# Altium project PCB_Project.PrjPcb
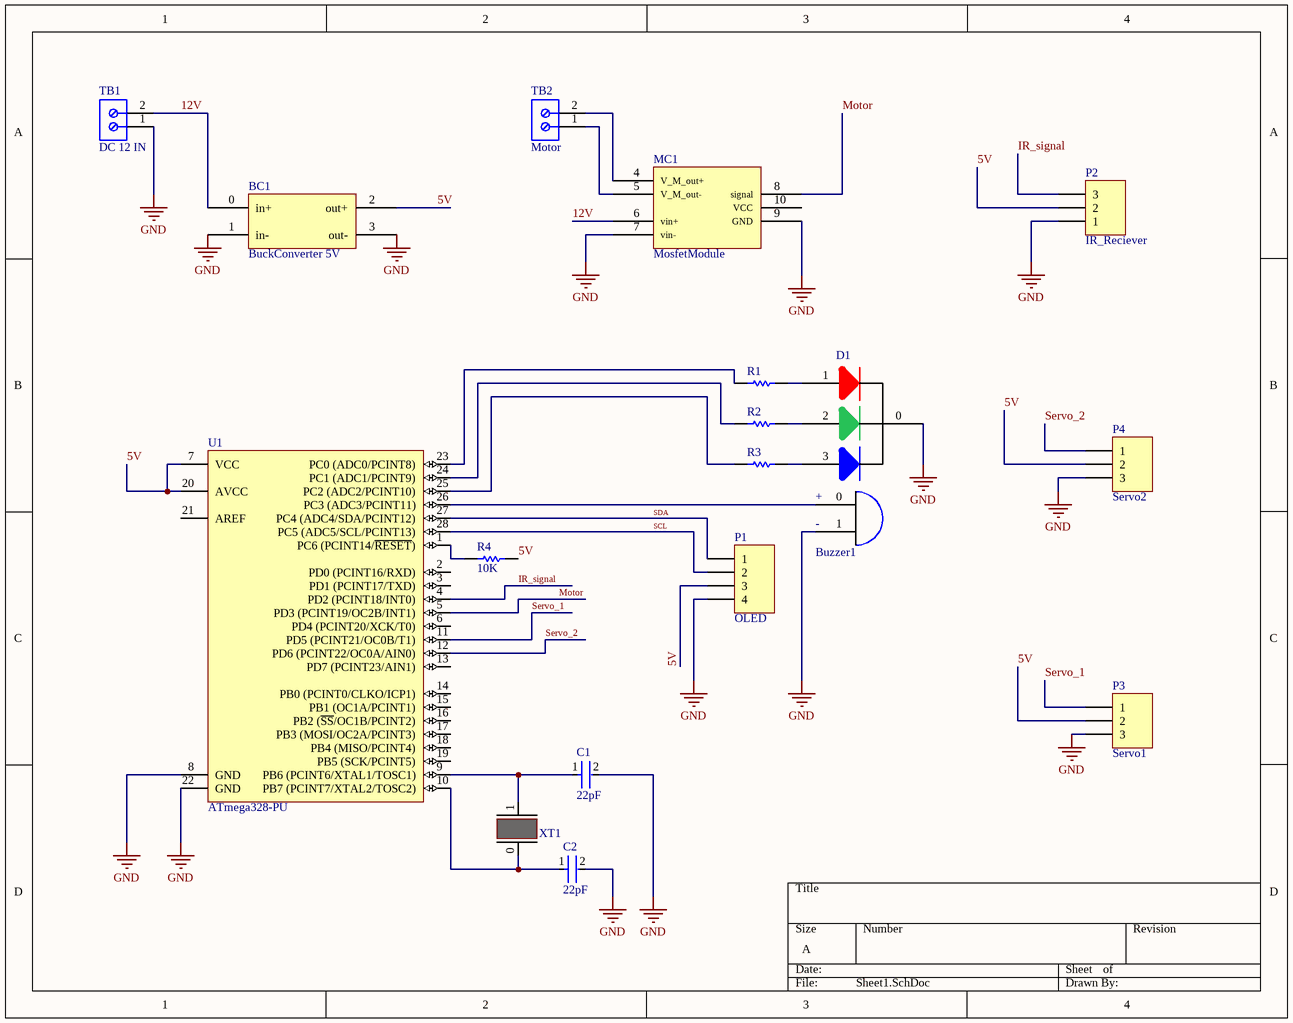
[diagram p0: Sheet1.SchDoc]
1 sheet, 18 parts. Net scope: global (net labels, ports and power ports of the same name join across sheets).
Board file: PCB1.PcbDoc

## Sheet Sheet1.SchDoc
size A; SheetNumber: 1; SheetTotal: 1

### Parts
BC1  BuckConverter 5V  [BUCK]
Buzzer1  Buzzer  [Buzzer]  (value not drawn)
C1  22pF  [FP-RDE0M1-MFG]
C2  22pF  [FP-RDE0M1-MFG]
D1  check foot print and real model  [RGB_LED]  (value not drawn)
MC1  MosfetModule  [MosfetMoterDriver]
P1  OLED  [HDR1X4]
P2  IR_Reciever  [HDR1X3]
P3  Servo1  [HDR1X3]
P4  Servo2  [HDR1X3]
R1  MFR-25FBF52-1K  [RESA60-630X240]  (value not drawn)
R2  MFR-25FBF52-1K  [RESA60-630X240]  (value not drawn)
R3  MFR-25FBF52-1K  [RESA60-630X240]  (value not drawn)
R4  10K  [RESA60-630X240]
TB1  DC 12 IN  [Terminal Block]
TB2  Motor  [Terminal Block]
U1  ATmega328-PU  [28P3]
XT1  Crystal Oscillator  [CrystalOscillator]  (value not drawn)

### Nets
GND: BC1.1(in-) BC1.3(out-) Buzzer1.1 C1.2 C2.2 D1.0 MC1.7(vin-) MC1.9(GND) P1.4 P2.1 P3.3 P4.3 TB1.1 U1.8(GND) U1.22(GND)
5V: BC1.2(out+) P1.3 P2.2 P3.2 P4.2 R4.2 U1.7(VCC) U1.20(AVCC)
12V: BC1.0(in+) MC1.6(vin+) TB1.2
IR_signal: P2.3 U1.4(PD2_(PCINT18/INT0))
Motor: MC1.8(signal) U1.5(PD3_(PCINT19/OC2B/INT1))
SCL: P1.2 U1.28(PC5_(ADC5/SCL/PCINT13))
SDA: P1.1 U1.27(PC4_(ADC4/SDA/PCINT12))
Servo_1: P3.1 U1.11(PD5_(PCINT21/OC0B/T1))
Servo_2: P4.1 U1.12(PD6_(PCINT22/OC0A/AIN0))
NetBuzzer1_0: Buzzer1.0 U1.26(PC3_(ADC3/PCINT11))
NetC1_1: C1.1 U1.9(PB6_(PCINT6/XTAL1/TOSC1)) XT1.1
NetC2_1: C2.1 U1.10(PB7_(PCINT7/XTAL2/TOSC2)) XT1.0
NetD1_1: D1.1 R1.2
NetD1_2: D1.2 R2.2
NetD1_3: D1.3 R3.2
NetMC1_4: MC1.4(V_M_out+) TB2.2
NetMC1_5: MC1.5(V_M_out-) TB2.1
NetR1_1: R1.1 U1.23(PC0_(ADC0/PCINT8))
NetR2_1: R2.1 U1.24(PC1_(ADC1/PCINT9))
NetR3_1: R3.1 U1.25(PC2_(ADC2/PCINT10))
NetR4_1: R4.1 U1.1(PC6_(PCINT14/~{RESET}))

Not connected (* = marked no-connect by the designer): MC1 10(VCC); U1 2(PD0_(PCINT16/RXD)) 3(PD1_(PCINT17/TXD)) 6(PD4_(PCINT20/XCK/T0)) 13(PD7_(PCINT23/AIN1)) 14(PB0_(PCINT0/CLKO/ICP1)) 15(PB1_(OC1A/PCINT1)) 16(PB2_(~{SS}/OC1B/PCINT2)) 17(PB3_(MOSI/OC2A/PCINT3)) 18(PB4_(MISO/PCINT4)) 19(PB5_(SCK/PCINT5)) 21(AREF)

### Notes on the sheet
- (in symbol Buzzer) +; -

### Library data of the parts
BC1 = BuckConverter
C1 C2 = CMP-06035-051680-1: Ceramic Capacitor 100nF ±10% 50V X7R Radial; Lead/Base Style: Kinked; Lead Diameter: 0.5mm; Lead Free: Lead Free; Mount: Through Hole; Package Quantity: 2000; Lead Pitch: 0.197inch; Capacitance: 100nF; Case/Package: Radial; Tolerance: 10%; Height - Seated (Max): 0.236inch; Max Operating Temperature: 125°C; Dielectric: X7R; Min Operating Temperature: -55°C; Voltage Rating (DC): 50V; Voltage Rating: 50V; Termination: Radial; Height: 3.5mm; Resistor Type: Ceramic; Width: 3.5mm; Packaging: Tape and Reel; Length: 0.157inch
D1 = RGB_LED
P1 = Header 4: Header, 4-Pin; LatestRevisionDate: 17-Jul-2002; LatestRevisionNote: Re-released for DXP Platform.; Publisher: Altium Limited
P2-P4 = Header 3: Header, 3-Pin; LatestRevisionDate: 17-Jul-2002; LatestRevisionNote: Re-released for DXP Platform.; Publisher: Altium Limited
R1-R4 = CMP-1659-00075-1: Axial Resistor, 1 KOhm, +/- 1%, 250 mW, -55 to 155 degC, 2-Pin THD, RoHS, Bulk; Voltage Rating: 250 V; Resistance: 10 kohm; Power Rating: 250 mW; ComponentLink2Description: Datasheet; RoHSCompliant: true; PackageReference: MFR-25; Case\Package: Axial; Max Operating Temperature: 155 degC; DatasheetVersion: Apr-13; Tolerance: 1%; ComponentLink1URL: http://www.yageo.com/; Length: 0.248 inch; ComponentLink2URL: http://www.yageo.com/documents/recent/Yageo%20LR_MFR_2013.pdf; Packaging: Bulk; Package Quantity: 200; PackageDescription: 2-Pin Axial Lead, Dia 2.4 mm, Body Length 6.3 mm; Min Operating Temperature: -55 degC; ComponentLink1Description: Manufacturer URL
TB1 TB2 = Terminal Block
U1 = CMP-0095-00015-2: 8-bit AVR Microcontroller, 32KB Flash, 1KB EEPROM, 2KB SRAM, 28-pin PDIP, Industrial Grade (-40°C to 85°C); ComponentLink3Description: ATmega48A/48PA/88A/88PA/168A/168PA/328/328P Summary; RevisionNote: DatasheetVersion updated. URLs added.; DatasheetVersion: revD, May-2011; ComponentLink1URL: http://www.atmel.com/; PackageVersion: revB, Sep-2001; PackageDescription: 28-lead (0.300"/7.62mm Wide) Plastic Dual Inline Package (PDIP); PackageReference: 28P3; ComponentLink1Description: Manufacturer URL; ComponentLink2Description: ATmega48A/48PA/88A/88PA/168A/168PA/328/328P Datasheet; ComponentLink3URL: http://www.atmel.com/dyn/resources/prod_documents/8271S.pdf; ComponentLink2URL: http://www.atmel.com/dyn/resources/prod_documents/8271.pdf